# EasyEDA Pro project triple_diode_v1.eprj

# Schematic Schematic1
Board Name: Board1; Create Date: 2024-10-03; Company: KC3LBR
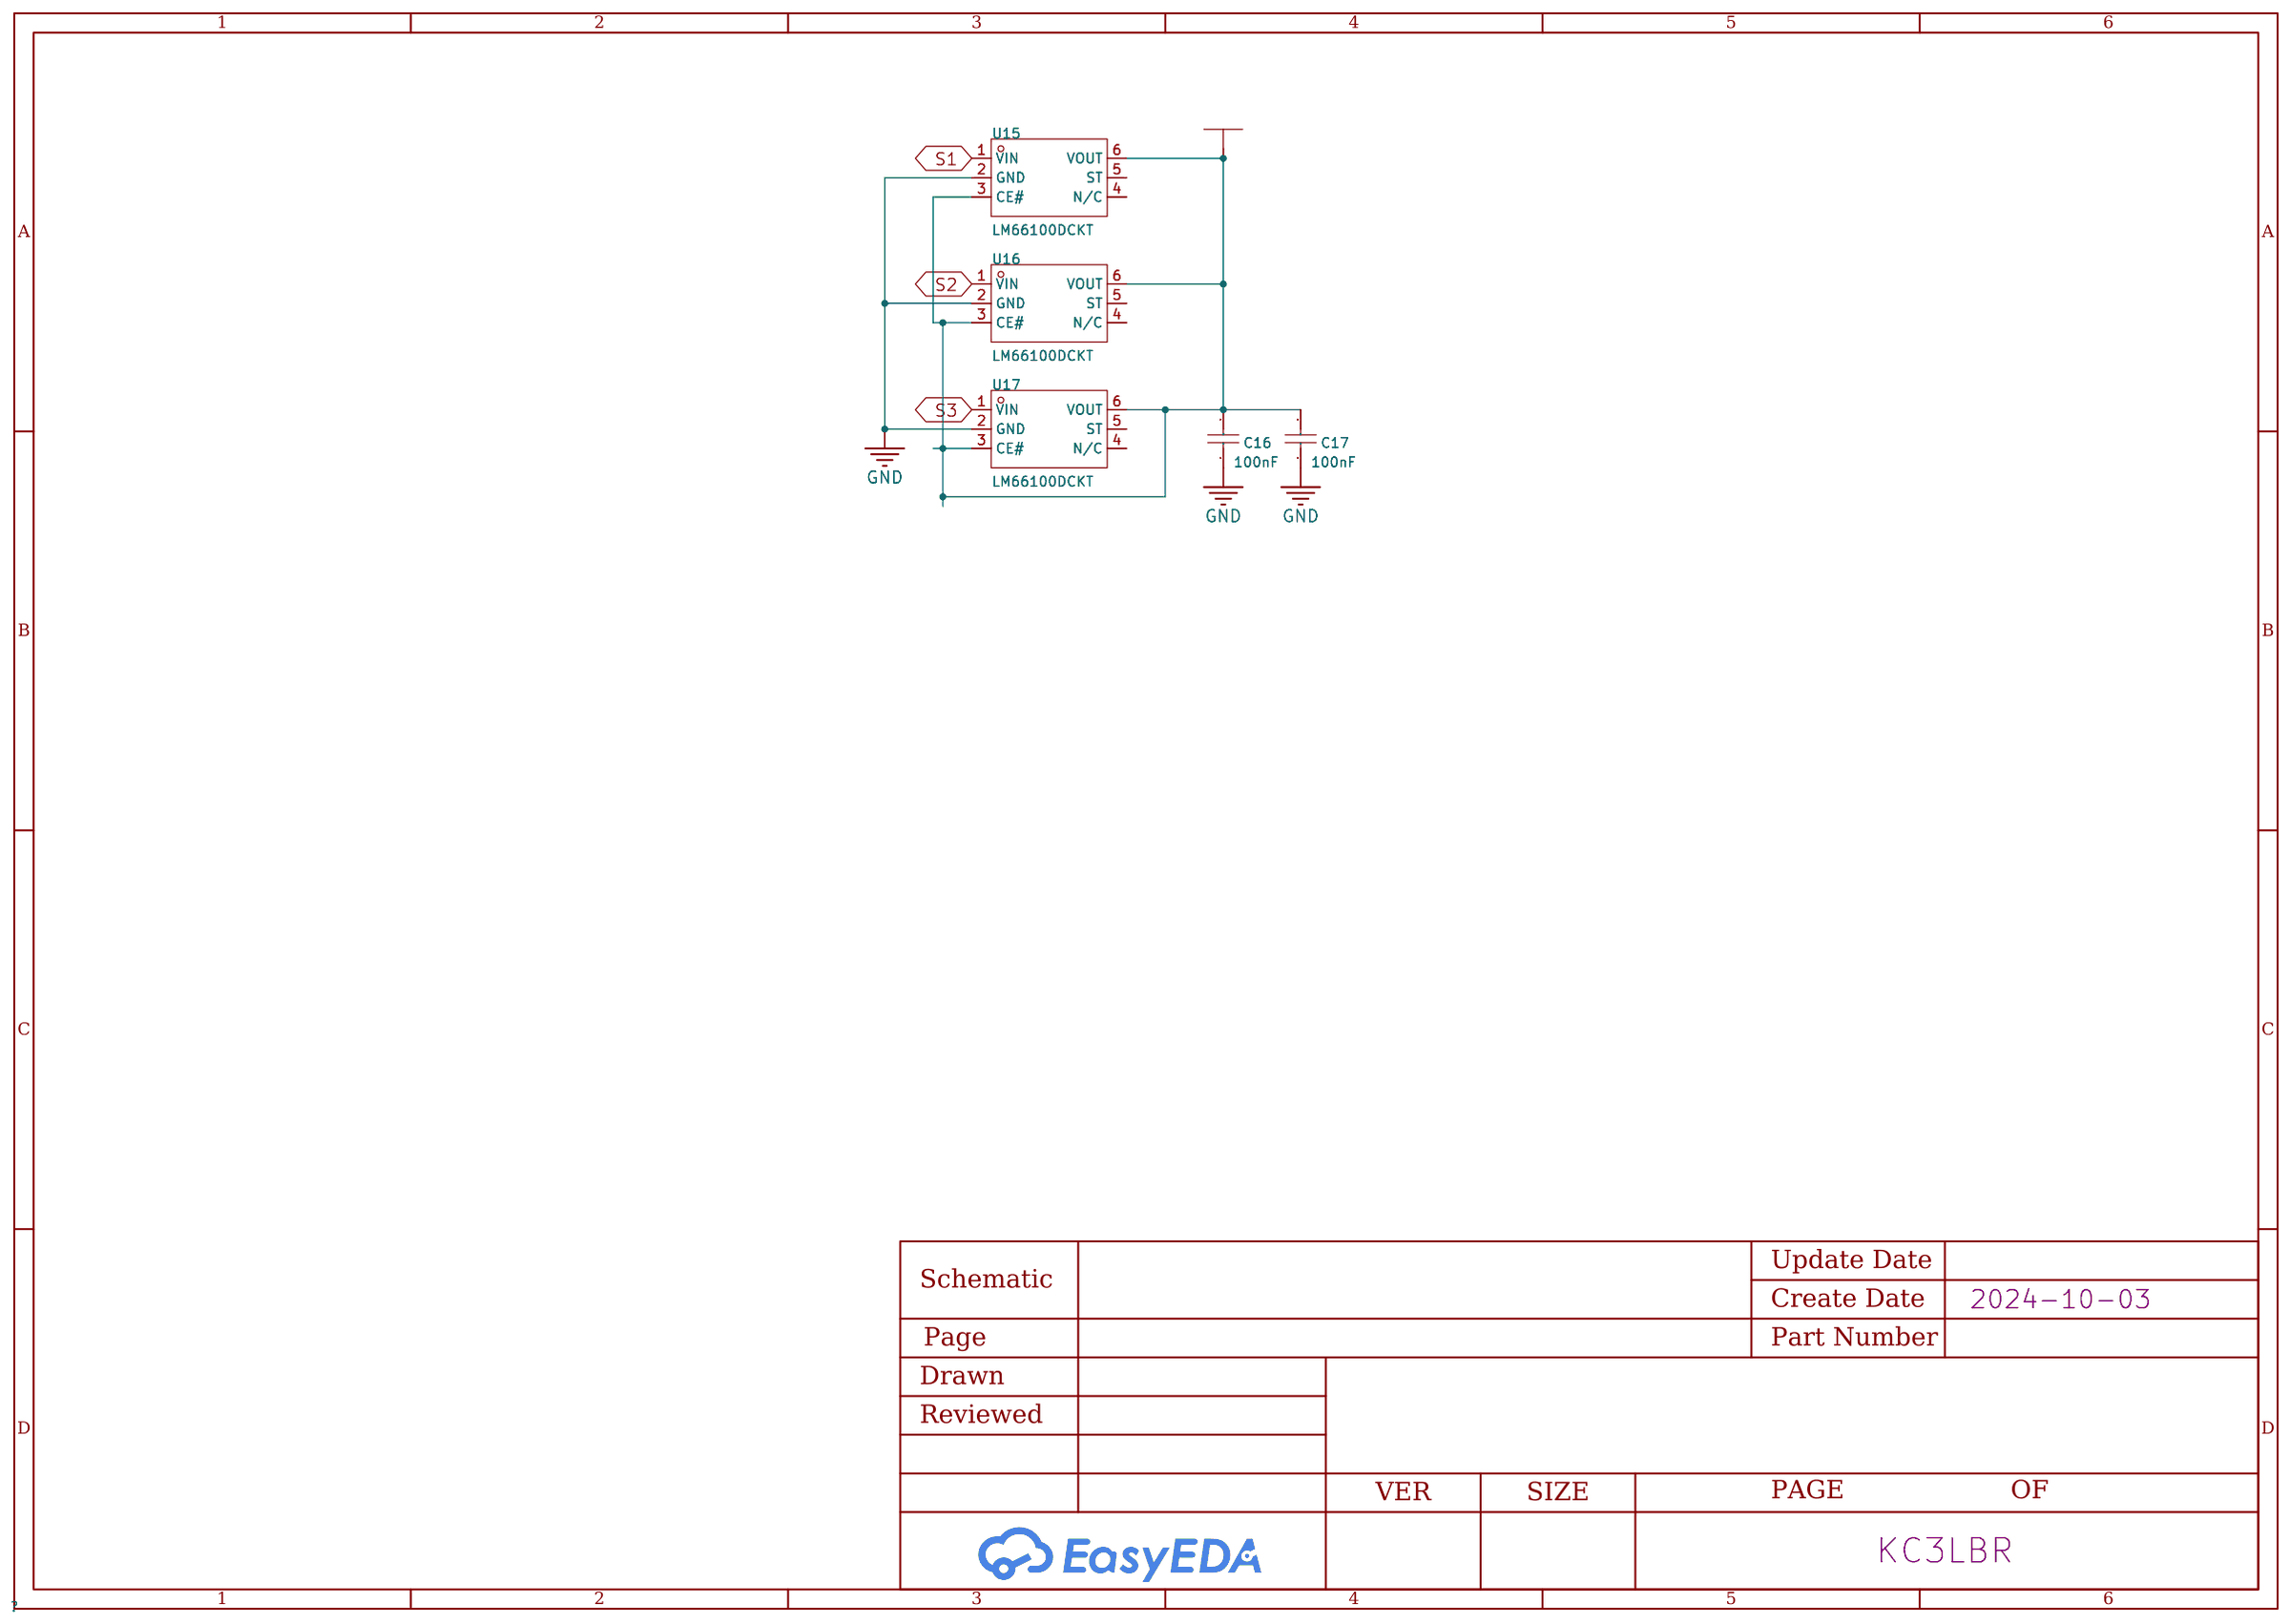
[diagram p0: schematic sheet]

## Parts
C16  100nF  [C0402_NEW]
C17  100nF  [C0402_NEW]
U15  LM66100DCKT  [SC-70-6_L2.0-W1.3-P0.65-LS2.1-BL]
U16  LM66100DCKT  [SC-70-6_L2.0-W1.3-P0.65-LS2.1-BL]
U17  LM66100DCKT  [SC-70-6_L2.0-W1.3-P0.65-LS2.1-BL]

## Library data of the parts
C16 C17 = CL05B104KO5NNNC: Capacitance: Tolerance:±10% Tolerance:±10% Voltage Rated: Temperature Coefficient:; LCSC Part Name: 100nF ±10% 16V; Supplier Part: C1525; Manufacturer: SAMSUNG(三星); Supplier Footprint: 0402; JLCPCB Part Class: Basic Part; Datasheet: https://atta.szlcsc.com/upload/public/pdf/source/20160103/1457707674891.pdf; Supplier: LCSC; Tolerance: ±10%
U15-U17 = LM66100DCKT_C2832141: Supplier Part: C2832141; Manufacturer: TI(德州仪器); Supplier Footprint: SC-70-6; JLCPCB Part Class: Extended Part; Datasheet: https://www.ti.com/cn/lit/gpn/lm66100; Supplier: LCSC; Output Current: 1.5A; Input Voltage: 1.5V~5.5V; Operating Temperature	-: -40℃~+105℃

## Nets
GND: C16.1 C17.1 U15.2(GND) U16.2(GND) U17.2(GND)
VBUS: C16.2 C17.2 U15.3(CE#) U15.6(VOUT) U16.3(CE#) U16.6(VOUT) U17.3(CE#) U17.6(VOUT)
S1: U15.1(VIN)
S2: U16.1(VIN)
S3: U17.1(VIN)

Not connected (* = marked no-connect by the designer): U15 4(N/C) 5(ST); U16 4(N/C) 5(ST); U17 4(N/C) 5(ST)

# Board PCB1
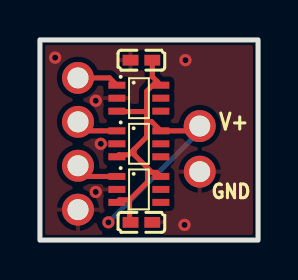
[diagram p1: board, top side]
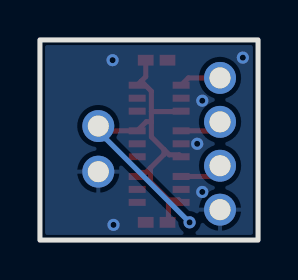
[diagram p2: board, bottom side, seen from below]

Outline 10.92 x 10.03 mm; copper layers: Top Layer, Bottom Layer. Coordinates in mm from the lower left corner of the outline.
Outline path: rectangle 0,10.03 10.92,0
Stack: Top Layer 0.035mm / Dielectric1 1.51mm FR4 er 4.5 / Bottom Layer 0.035mm

## Design rules (mm)
template: JLCPCB Capability(Two Layers Board)
spacing copperThickness1oz (default): track to track 0.102, other pairs 0.152 to 0.3
spacing copperThickness2oz: track to track 0.203, other pairs 0.152 to 0.3
track width copperThickness1oz (default): min 0.127, default 0.254, max 2.54
track width copperThickness2oz: min 0.203, default 0.254, max 2.54
differential pair differentialPair (default): width min 0.127, default 0.254, max 2.54; gap min 0.152, default 0.152
via viaSize (default): diameter min 0.5, default 0.61, max 10; hole min 0.3, default 0.305, max 6.3

## Placement (name value [footprint] x y rotation side)
C16  100nF  [C0402_NEW]  5.08 9.02 0 top
C17  100nF  [C0402_NEW]  5.08 0.89 180 top
GND  LM66100DCKT  [SC-70-6_L2.0-W1.3-P0.65-LS2.1-BL]  4.95 2.54 270 top
NOREF  -  [Pad_e20]  8 5.71 0 top
NOREF#2  -  [Pad_e5924]  1.91 8.13 0 top
NOREF#3  -  [Pad_e16]  1.91 5.93 0 top
NOREF#4  -  [Pad_e19]  1.91 3.73 0 top
NOREF#5  -  [Pad_e785]  1.91 1.52 0 top
NOREF#6  -  [Pad_e52]  8 3.43 0 top
U15  LM66100DCKT  [SC-70-6_L2.0-W1.3-P0.65-LS2.1-BL]  4.95 7.11 270 top
U16  LM66100DCKT  [SC-70-6_L2.0-W1.3-P0.65-LS2.1-BL]  4.95 4.83 270 top

## Footprints (pads in the part's own frame, mm; a bottom-side part is the same pattern mirrored in y, then rotated)
C0402_NEW
  rect 0.79x0.54 smd: 1(-0.545,0) 2(0.545,0)
Pad_e16
  round 1.6 hole 1.05: 1(0,0)
Pad_e19
  round 1.6 hole 1.05: 1(0,0)
Pad_e20
  round 1.6 hole 1.05: 1(0,0)
Pad_e52
  round 1.6 hole 1.05: 1(0,0)
Pad_e785
  round 1.6 hole 1.05: 1(0,0)
Pad_e5924
  round 1.6 hole 1.05: 1(0,0)
SC-70-6_L2.0-W1.3-P0.65-LS2.1-BL
  rect 0.35x0.85 smd: 1(-0.65,-1.1) 2(0,-1.1) 3(0.65,-1.1) 4(0.65,1.1) 5(0,1.1) 6(-0.65,1.1)

## Nets
GND: C16.1 C17.1 GND.2 NOREF#5.1 NOREF#6.1 U15.2 U16.2
VBUS: C16.2 C17.2 GND.3 GND.6 NOREF.1 U15.3 U15.6 U16.3 U16.6
S1: NOREF#2.1 U15.1
S2: NOREF#3.1 U16.1
S3: GND.1 NOREF#4.1

Pads without a net: GND 4 5; U15 4 5; U16 4 5

## Via types
v1: diameter 0.61, hole 0.305, Top Layer to Bottom Layer, 7 vias

## Routing (per net, layer and track width the routed paths; a pad name or vN(x,y) marks a point on that pad's centre or on a via; arc(x,y) is an arc through that point)
GND:
  vias: v1(0.76,9.14) v1(2.79,6.98) v1(2.79,2.41) v1(3.05,4.83) v1(7.29,9.02) v1(7.24,0.76)
VBUS: length 23
  Top Layer w0.254: 5.34,5.93 5.6,5.93 U16.6 7.61,5.48 8,5.08 ; 5.34,5.93 5.34,6.44 ; 5.34,5.93 5.34,5.17 4.71,4.54 ; 5.39,3.62 5.39,2.92 4.49,2.02 ; 5.39,3.62 5.61,3.39 5.85,3.39 GND.6 ; 5.39,3.62 4.71,4.29 4.71,4.54 ; C17.2 4.49,0.94 4.49,2.02 ; 5.85,7.97 U15.6 ; 5.85,7.97 5.62,8.19 C16.2 ; 5.85,7.97 5.34,7.46 5.34,6.44 ; 4.71,4.54 4.44,4.27 3.95,4.27 U16.3 ; 4.49,2.02 3.98,2.02 GND.3 ; U15.3 3.87,6.44 5.34,6.44
  Bottom Layer w0.254: 8,5.08 7.62,5.08 v1(3.43,0.89)
S1: length 2.1
  Top Layer w0.254: NOREF#2.1 3.49,8.13 U15.1
S2: length 2.1
  Top Layer w0.254: U16.1 2.36,5.48 NOREF#3.1
S3: length 2.2
  Top Layer w0.254: NOREF#4.1 2.44,3.19 GND.1

## Copper pours and planes (outline as drawn; the poured copper is in the pictures)
GND on Top Layer: -28.07,52.32 14.86,52.32 14.86,-1.02 -28.07,-1.02
GND on Bottom Layer: -35.05,15.24 18.8,15.24 18.8,-37.72 -35.05,-37.72

## Text on the board
Top Silkscreen Layer: V+
